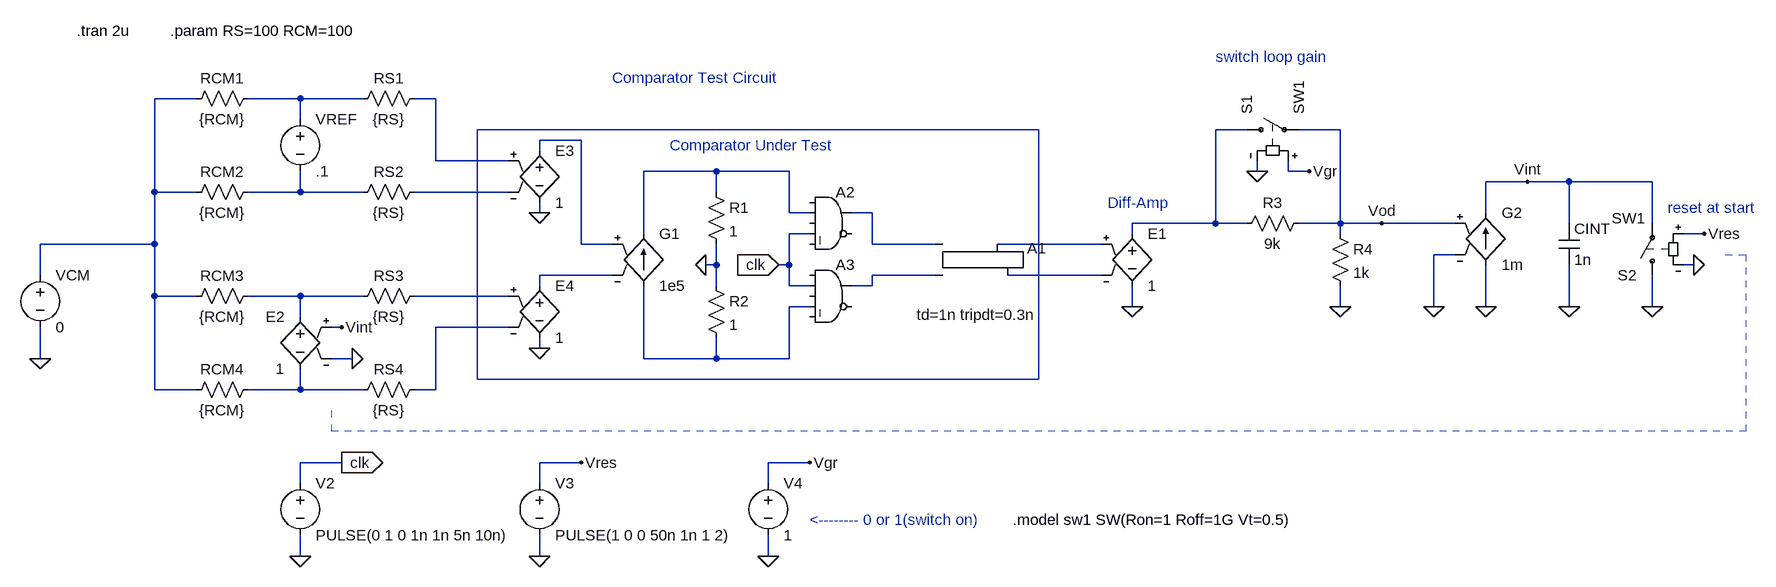
[diagram p0: schematic comparator_test3.asc]
comparator_test3.asc, the LTspice schematic file:
Version 4
SHEET 1 1860 680
WIRE -576 -128 -640 -128
WIRE -416 -128 -496 -128
WIRE -320 -128 -416 -128
WIRE -208 -128 -240 -128
WIRE -416 -96 -416 -128
WIRE 1040 -80 992 -80
WIRE 1184 -80 1120 -80
WIRE 16 -64 -48 -64
WIRE -48 -48 -48 -64
WIRE -208 -32 -208 -128
WIRE -96 -32 -208 -32
WIRE 224 -16 112 -16
WIRE 336 -16 224 -16
WIRE 1056 -16 1056 -32
WIRE 1104 -16 1104 -32
WIRE 1136 -16 1104 -16
WIRE 1472 0 1408 0
WIRE 1536 0 1472 0
WIRE 1664 0 1536 0
WIRE -640 16 -640 -128
WIRE -576 16 -640 16
WIRE -416 16 -416 -16
WIRE -416 16 -496 16
WIRE -320 16 -416 16
WIRE -96 16 -240 16
WIRE 224 16 224 -16
WIRE -48 48 -48 32
WIRE 336 48 336 -16
WIRE 368 48 336 48
WIRE 464 48 432 48
WIRE 1408 48 1408 0
WIRE 992 64 992 -80
WIRE 992 64 864 64
WIRE 1040 64 992 64
WIRE 1184 64 1184 -80
WIRE 1184 64 1120 64
WIRE 1248 64 1184 64
WIRE 1360 64 1248 64
WIRE 1536 64 1536 0
WIRE 1664 64 1664 0
WIRE 112 80 112 -16
WIRE 368 80 336 80
WIRE 864 80 864 64
WIRE 1184 80 1184 64
WIRE 1744 80 1712 80
WIRE -640 96 -640 16
WIRE -640 96 -816 96
WIRE 16 96 16 -64
WIRE 64 96 16 96
WIRE 464 96 464 48
WIRE 560 96 464 96
WIRE 816 96 656 96
WIRE 1360 112 1328 112
WIRE 224 128 224 96
WIRE 224 128 208 128
WIRE 336 128 336 80
WIRE 336 128 320 128
WIRE 1728 128 1712 128
WIRE -816 144 -816 96
WIRE 64 144 -48 144
WIRE 560 144 464 144
WIRE 816 144 672 144
WIRE -48 160 -48 144
WIRE 224 160 224 128
WIRE 336 160 336 128
WIRE 368 160 336 160
WIRE 464 160 464 144
WIRE 464 160 432 160
WIRE -640 176 -640 96
WIRE -576 176 -640 176
WIRE -416 176 -496 176
WIRE -320 176 -416 176
WIRE -96 176 -240 176
WIRE 368 192 336 192
WIRE 864 192 864 160
WIRE 1184 192 1184 160
WIRE 1328 192 1328 112
WIRE 1408 192 1408 128
WIRE 1536 192 1536 128
WIRE 1664 192 1664 144
WIRE -416 208 -416 176
WIRE -352 224 -368 224
WIRE -96 224 -208 224
WIRE -48 256 -48 240
WIRE -816 272 -816 224
WIRE -336 272 -368 272
WIRE 112 272 112 160
WIRE 224 272 224 240
WIRE 224 272 112 272
WIRE 336 272 336 192
WIRE 336 272 224 272
WIRE -640 320 -640 176
WIRE -576 320 -640 320
WIRE -416 320 -416 288
WIRE -416 320 -496 320
WIRE -320 320 -416 320
WIRE -208 320 -208 224
WIRE -208 320 -240 320
WIRE -352 432 -416 432
WIRE 16 432 -48 432
WIRE 368 432 304 432
WIRE -416 464 -416 432
WIRE -48 464 -48 432
WIRE 304 464 304 432
WIRE -416 576 -416 544
WIRE -48 576 -48 544
WIRE 304 576 304 544
FLAG 208 128 0
FLAG 320 128 clk
IOPIN 320 128 In
FLAG 864 192 0
FLAG 1248 64 Vod
FLAG -416 576 0
FLAG -352 432 clk
IOPIN -352 432 Out
FLAG 1184 192 0
FLAG 1056 -16 0
FLAG 1136 -16 Vgr
FLAG 1328 192 0
FLAG 1408 192 0
FLAG 1536 192 0
FLAG 1728 128 0
FLAG 1744 80 Vres
FLAG 1664 192 0
FLAG 1472 0 Vint
FLAG -48 576 0
FLAG 16 432 Vres
FLAG 304 576 0
FLAG 368 432 Vgr
FLAG -48 48 0
FLAG -48 256 0
FLAG -336 272 0
FLAG -352 224 Vint
FLAG -816 272 0
SYMBOL Digital\\srflop 608 48 R0
WINDOW 39 -76 157 Left 0
SYMATTR SpiceLine td=1n tripdt=0.3n
SYMATTR InstName A1
SYMBOL Digital\\and 400 0 R0
SYMATTR InstName A2
SYMBOL Digital\\and 400 112 R0
SYMATTR InstName A3
SYMBOL res 208 0 R0
SYMATTR InstName R1
SYMATTR Value 1
SYMBOL res 208 144 R0
SYMATTR InstName R2
SYMATTR Value 1
SYMBOL g 112 64 R0
SYMATTR InstName G1
SYMATTR Value 1e5
SYMBOL e 864 64 R0
SYMATTR InstName E1
SYMATTR Value 1
SYMBOL voltage -416 -112 R0
SYMATTR InstName VREF
SYMATTR Value .1
SYMBOL voltage -416 448 R0
WINDOW 123 0 0 Left 0
WINDOW 39 0 0 Left 0
SYMATTR InstName V2
SYMATTR Value PULSE(0 1 0 1n 1n 5n 10n)
SYMBOL res 1024 80 R270
WINDOW 0 32 56 VTop 0
WINDOW 3 0 56 VBottom 0
SYMATTR InstName R3
SYMATTR Value 9k
SYMBOL res 1168 64 R0
SYMATTR InstName R4
SYMATTR Value 1k
SYMBOL sw 1024 -80 R270
SYMATTR InstName S1
SYMATTR Value SW1
SYMBOL g 1408 32 R0
SYMATTR InstName G2
SYMATTR Value 1m
SYMBOL sw 1664 160 R180
WINDOW 3 11 104 Left 0
SYMATTR InstName S2
SYMATTR Value SW1
SYMBOL cap 1520 64 R0
SYMATTR InstName CINT
SYMATTR Value 1n
SYMBOL e -416 192 M0
SYMATTR InstName E2
SYMATTR Value 1
SYMBOL voltage -48 448 R0
WINDOW 123 0 0 Left 0
WINDOW 39 0 0 Left 0
SYMATTR InstName V3
SYMATTR Value PULSE(1 0 0 50n 1n 1 2)
SYMBOL voltage 304 448 R0
WINDOW 123 0 0 Left 0
WINDOW 39 0 0 Left 0
SYMATTR InstName V4
SYMATTR Value 1
SYMBOL e -48 -64 R0
SYMATTR InstName E3
SYMATTR Value 1
SYMBOL e -48 144 R0
SYMATTR InstName E4
SYMATTR Value 1
SYMBOL res -336 -112 R270
WINDOW 0 32 56 VTop 0
WINDOW 3 0 56 VBottom 0
SYMATTR InstName RS1
SYMATTR Value {RS}
SYMBOL res -336 32 R270
WINDOW 0 32 56 VTop 0
WINDOW 3 0 56 VBottom 0
SYMATTR InstName RS2
SYMATTR Value {RS}
SYMBOL res -592 -112 R270
WINDOW 0 32 56 VTop 0
WINDOW 3 0 56 VBottom 0
SYMATTR InstName RCM1
SYMATTR Value {RCM}
SYMBOL res -592 32 R270
WINDOW 0 32 56 VTop 0
WINDOW 3 0 56 VBottom 0
SYMATTR InstName RCM2
SYMATTR Value {RCM}
SYMBOL res -336 192 R270
WINDOW 0 32 56 VTop 0
WINDOW 3 0 56 VBottom 0
SYMATTR InstName RS3
SYMATTR Value {RS}
SYMBOL res -336 336 R270
WINDOW 0 32 56 VTop 0
WINDOW 3 0 56 VBottom 0
SYMATTR InstName RS4
SYMATTR Value {RS}
SYMBOL res -592 192 R270
WINDOW 0 32 56 VTop 0
WINDOW 3 0 56 VBottom 0
SYMATTR InstName RCM3
SYMATTR Value {RCM}
SYMBOL res -592 336 R270
WINDOW 0 32 56 VTop 0
WINDOW 3 0 56 VBottom 0
SYMATTR InstName RCM4
SYMATTR Value {RCM}
SYMBOL voltage -816 128 R0
WINDOW 123 0 0 Left 0
WINDOW 39 0 0 Left 0
SYMATTR InstName VCM
SYMATTR Value 0
TEXT -760 -232 Left 0 !.tran 2u
TEXT 64 -160 Left 0 ;Comparator Test Circuit
TEXT 920 32 Right 0 ;Diff-Amp
TEXT 152 -56 Left 0 ;Comparator Under Test
TEXT 680 520 Left 0 !.model sw1 SW(Ron=1 Roff=1G Vt=0.5)
TEXT 368 520 Left 0 ;<-------- 0 or 1(switch on)
TEXT 992 -192 Left 0 ;switch loop gain
TEXT 1688 40 Left 0 ;reset at start
TEXT -616 -232 Left 0 !.param RS=100 RCM=100
LINE Normal -368 384 -368 352 2
LINE Normal 1808 384 -368 384 2
LINE Normal 1808 112 1808 384 2
LINE Normal 1776 112 1808 112 2
RECTANGLE Normal 720 304 -144 -80

The netlist it stands for:
* comparator_test3.asc
A1 N009 N012 0 0 0 N013 N010 0 SRFLOP td=1n tripdt=0.3n
A2 0 N006 0 clk 0 0 N009 0 AND
A3 0 clk 0 N016 0 0 N012 0 AND
R1 N006 0 1
R2 0 N016 1
G1 N016 N006 N005 N011 1e5
E1 N004 0 N010 N013 1
VREF N002 N007 .1
V2 clk 0 PULSE(0 1 0 1n 1n 5n 10n)
R3 N004 Vod 9k
R4 Vod 0 1k
S1 N004 Vod Vgr 0 SW1
G2 0 Vint Vod 0 1m
S2 0 Vint Vres 0 SW1
CINT Vint 0 1n
E2 N014 N018 Vint 0 1
V3 Vres 0 PULSE(1 0 0 50n 1n 1 2)
V4 Vgr 0 1
E3 N005 0 N003 N008 1
E4 N011 0 N015 N017 1
RS1 N002 N003 {RS}
RS2 N007 N008 {RS}
RCM1 N001 N002 {RCM}
RCM2 N001 N007 {RCM}
RS3 N014 N015 {RS}
RS4 N018 N017 {RS}
RCM3 N001 N014 {RCM}
RCM4 N001 N018 {RCM}
VCM N001 0 0
.tran 2u
* Comparator Test Circuit
* Diff-Amp
* Comparator Under Test
.model sw1 SW(Ron=1 Roff=1G Vt=0.5)
* <-------- 0 or 1(switch on)
* switch loop gain
* reset at start
.param RS=100 RCM=100
.backanno
.end